# EAGLE design PowerRailV2 (EAGLE 9.6.2)
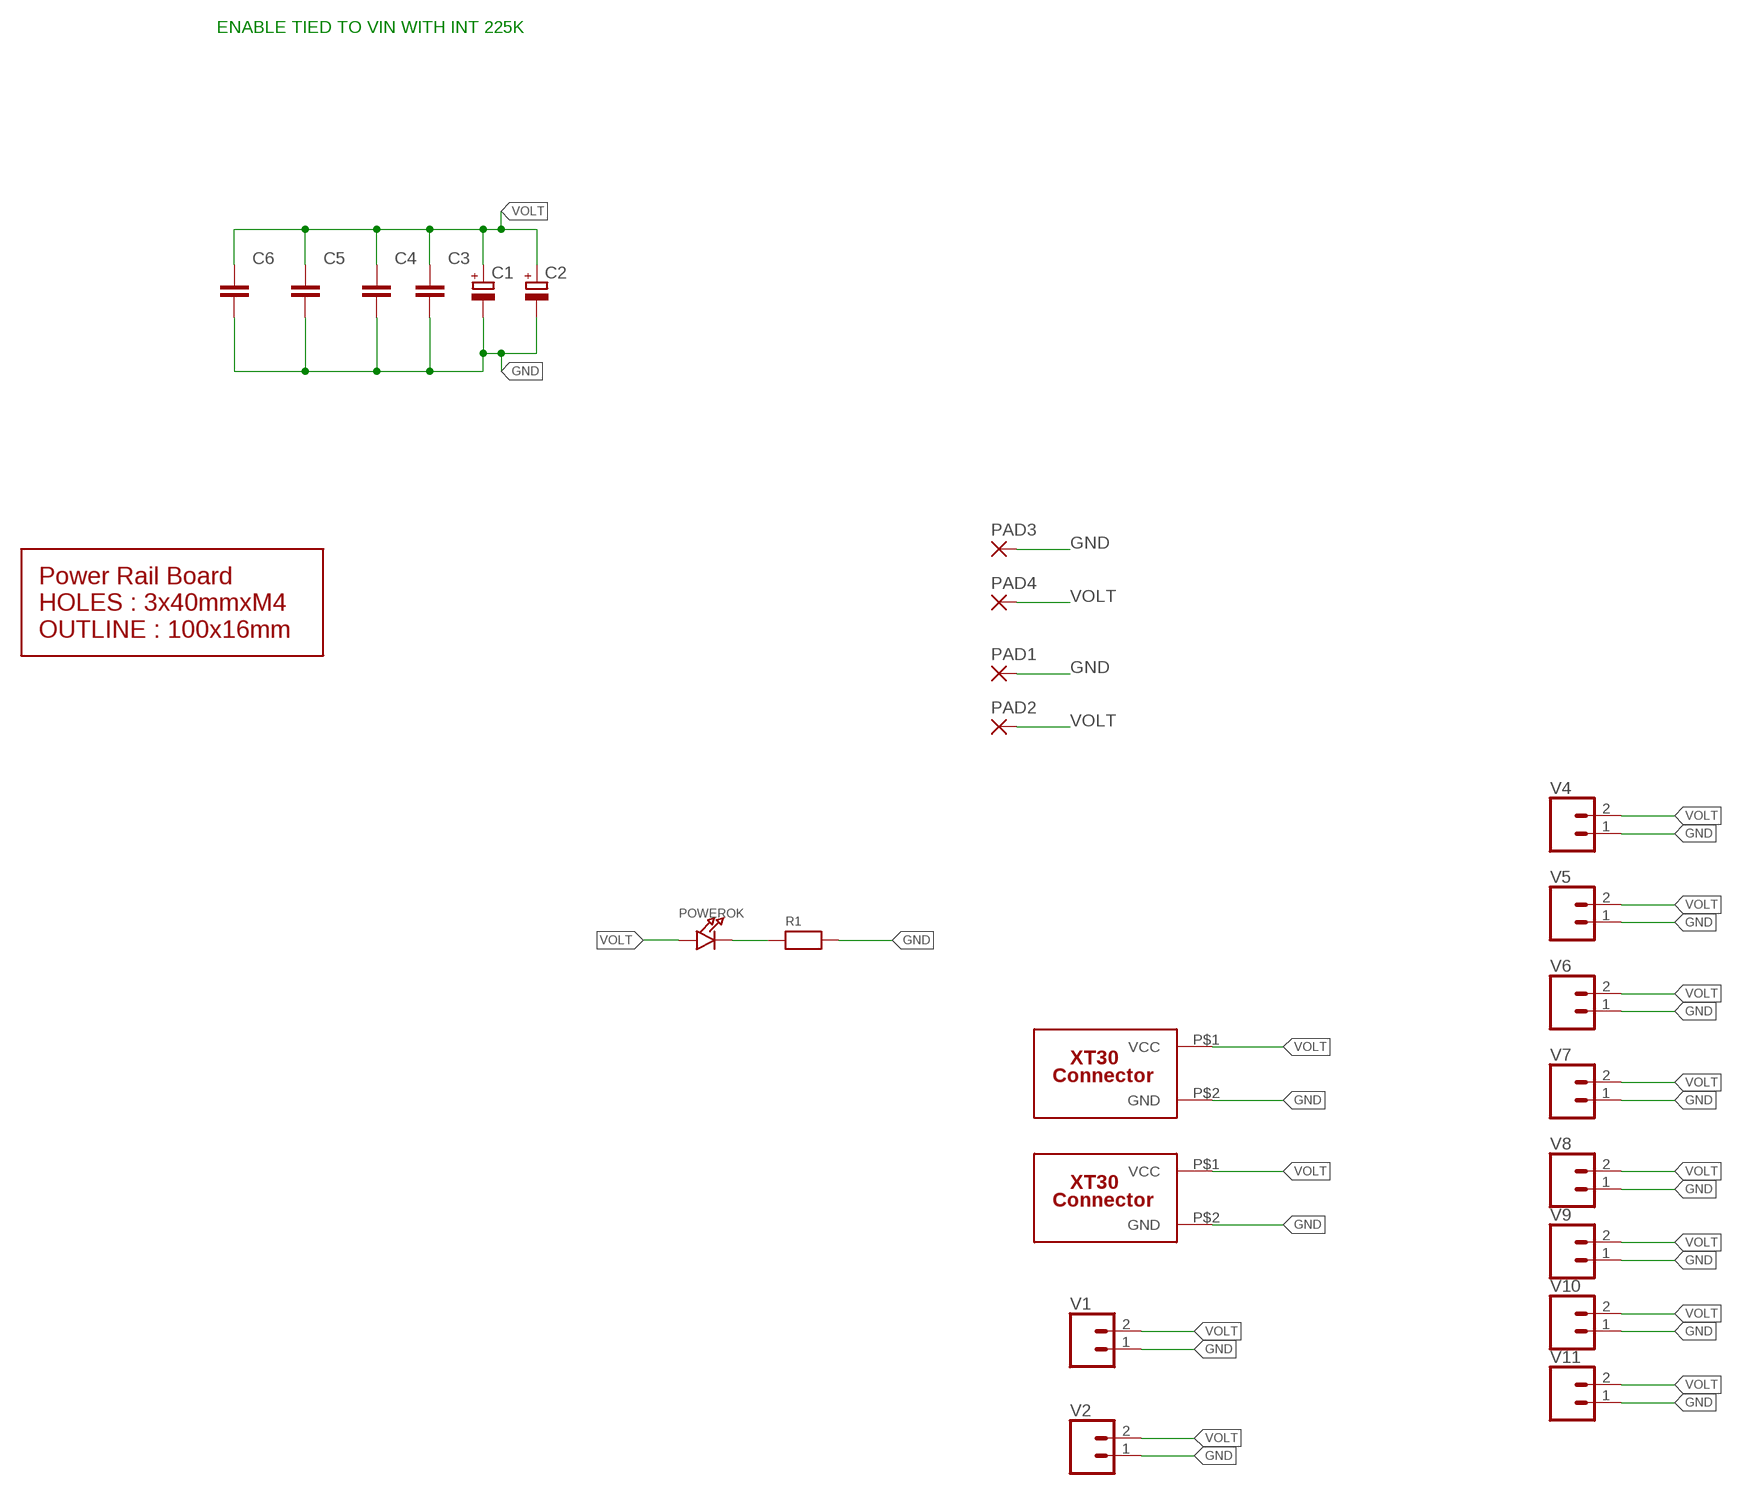
[diagram p0: schematic, sheet 1]

## Parts
C1  CPOL-EUE5-6  [E5-6]
C2  CPOL-EUE5-6  [E5-6]
C3  CAPACITOR_NPOL-0805  [C805]
C4  CAPACITOR_NPOL-0805  [C805]
C5  CAPACITOR_NPOL-1206  [C1206]
C6  CAPACITOR_NPOL-1206  [C1206]
PAD1  SMD2  [SMD1,27-2,54]
PAD2  SMD2  [SMD1,27-2,54]
PAD3  SMD2  [SMD1,27-2,54]
PAD4  SMD2  [SMD1,27-2,54]
POWEROK  LED0805  [CHIPLED_0805]
R1  RESISTOR0805  [0805]
U$3  BOARD_POWERRAI_PCB  [POWERRAIL_8-LED]
U$4  XT30  [XT30-VERT]
U$6  XT30  [XT30-VERT]
V1  CONN_023.5MM  [SCREWTERMINAL-3.5MM-2]
V2  CONN_023.5MM  [SCREWTERMINAL-3.5MM-2]
V4  CONN_023.5MM  [SCREWTERMINAL-3.5MM-2]
V5  CONN_023.5MM  [SCREWTERMINAL-3.5MM-2]
V6  CONN_023.5MM  [SCREWTERMINAL-3.5MM-2]
V7  CONN_023.5MM  [SCREWTERMINAL-3.5MM-2]
V8  CONN_023.5MM  [SCREWTERMINAL-3.5MM-2]
V9  CONN_023.5MM  [SCREWTERMINAL-3.5MM-2]
V10  CONN_023.5MM  [SCREWTERMINAL-3.5MM-2]
V11  CONN_023.5MM  [SCREWTERMINAL-3.5MM-2]

## Nets
GND: C1.- C2.- C3.2 C4.2 C5.2 C6.2 PAD1.1(P) PAD3.1(P) R1.2 U$4.P$2(GND) U$6.P$2(GND) V1.1 V2.1 V4.1 V5.1 V6.1 V7.1 V8.1 V9.1 V10.1 V11.1
N$3: POWEROK.C R1.1
VOLT: C1.+ C2.+ C3.1 C4.1 C5.1 C6.1 PAD2.1(P) PAD4.1(P) POWEROK.A U$4.P$1(VCC) U$6.P$1(VCC) V1.2 V2.2 V4.2 V5.2 V6.2 V7.2 V8.2 V9.2 V10.2 V11.2

## Notes on the sheet
- ENABLE TIED TO VIN WITH INT 225K

## Library data of the parts
C1 C2 = resistor:CPOL-EU: POLARIZED CAPACITOR, European symbol
C3-C6 = dp_devices:CAPACITOR_NPOL: Non-Polarized capacitor in various packages
PAD1-PAD4 = wirepad:SMD2: SMD PAD
POWEROK = microbuilder:LED: LED 0603 - 0603 Surface Mount Package 2mA: Green LED - Low Power (3.9mcd, 2ma, 1.7Vf) - Digikey: 475-2709-2-ND Orange LED - Low Power (9.8mcd, 2ma, 1.8Vf) - Digikey: 475-1194-2-ND Red LED - Low Power (5mcd, 2ma, 1.8Vf) - Digikey: 475-1195-2-ND Yellow LED - Low Power (7mcd, 2ma, 1.8Vf) - Digikey: 475-1196-2-ND 5mA: Blue LED - Low Power (17mcd, 5ma, 2.9Vf) - Digikey: LNJ937W8CRACT-ND 0805 - 0805 Surface Mount Package 2mA: Red LED (8.8mcd, 2mA, 1.8Vf, Clear) - Low Power [Digikey: 475-2510-1-ND] Green LED (5mcd, 2mA, 1.8Vf, Clear) - Low Power [Digikey: 475-2730-1-ND] Yellow LED (11.3mcd, 2mA, 1.8Vf, Clear) - Low Power [Digikey: 475-2555-1-ND] 20mA: Red LED (104mcd, 20mA, Diffused) - LS R976 [Digikey: 475-1278-6-ND] Red LED (12mcd, 20mA, 2.0Vf, Clear) - APT2012EC [Digikey: 754-1128-1-ND] Green LED (15mcd, 20mA, 2.2Vf, Clear) - APT2012GC [Digikey: 754-1131-1-ND] Orange LED (160mcd, 20mA, 2.1Vf, Clear) - APT2012SECK [Digikey: 754-1130-1-ND] 1206 - 1206 Surface Mount Package Green LED (26mcd, 20mA, Diffused) - LG N971 [Digikey: 475-1407-6-ND] Red LED (15mcd, 20mA, Diffused) - LH N974 [Digikey: 475-1416-6-ND]
R1 = microbuilder:RESISTOR: Resistors 0402 - 0402 Surface Mount Package 22 Ohm 1% 1/16W [Digikey: 311-22.0LRTR-ND] 33 Ohm 5% 1/16W 1.0K 5% 1/16W 1.5K 5% 1/16W 2.0K 1% 1/16W 10.0K 1% 1/16W [Digikey: 311-10.0KLRTR-ND] 10.0K 5% 1/16W [Digikey: RMCF0402JT10K0TR-ND] 12.1K 1% 1/16W [Digikey: 311-22.0LRTR-ND] 100.0K 5% 1/16W 0603 - 0603 Surface Mount Package 0 Ohm 1/10 Watt 1% Resistor 15 Ohm 1/10 Watt 1% Resistor 33 Ohm 1/10 Watt 1% Resistor 49.9 Ohm 1/10 Watt 1% Resistor 100 Ohm 1/10 Watt 1% Resistor 150 Ohm 1/10 Watt 1% Resistor 240 Ohm 1/10 Watt 1% Resistor 390 Ohm 1/10 Watt 1% Resistor 560 Ohm 1/10 Watt 1% Resistor 680 Ohm 1/10 Watt 1% Resistor 750 Ohm 1/10 Watt 1% Resistor 1.0K Ohm 1/10 Watt 1% Resistor 1.5K Ohm 1/10 Watt 1% Resistor 2.0K Ohm 1/10 Watt 1% Resistor 2.2K Ohm 1/10 Watt 1% Resistor 3.3K Ohm 1/10 Watt 1% Resistor 4.7K Ohm 1/10 Watt 1% Resistor 10.0K Ohm 1/10 Watt 1% Resistor 12.0K Ohm 1/10 Watt 1% Resistor 12.1K Ohm 1/10 Watt 1% Resistor 20.0K Ohm 1/10 Watt 1% Resistor 33.0K Ohm 1/10 Watt 1% Resistor 100.0K Ohm 1/10 Watt 1% Resistor 0805 - 0805 Surface Mount Package 0 Ohm 1/8 Watt 1% Resistor 33 Ohm 1/8 Watt 1% Resistor 100 Ohm 1/8 Watt 1% Resistor 150 Ohm 1/8 Watt 1% Resistor 200 Ohm 1/8 Watt 1% Resistor 240 Ohm 1/8 Watt 1% Resistor 330 Ohm 1/8 Watt 1% Resistor 390 Ohm 1/8 Watt 1% Resistor 470 Ohm 1/8 Watt 1% Resistor 1.0K Ohm 1/8 Watt 1% Resistor 1.5K Ohm 1/8 Watt 1% Resistor 2.0K Ohm 1/8 Watt 1% Resistor 4.7K Ohm 1/8 Watt 1% Resistor 5.1K Ohm 1/8 Watt 1% Resistor 5.6K Ohm 1/8 Watt 1% Resistor 10.0K Ohm 1/8 Watt 1% Resistor 22.0K Ohm 1/8 Watt 1% Resistor 33.0K Ohm 1/8 Watt 1% Resistor 100K Ohm 1/8 Watt 1% Resistor 1206 - 1206 Surface Mount Package 2012 - 2010 Surface Mount Package 0.11 Ohm 1/2 Watt 1% Resistor - Digikey: RHM.11UCT-ND
U$3 = MyBreadBoards:BOARD_POWERRAI_PCB
U$4 U$6 = MyBreadBoards:XT30
V1 V2 V4-V11 = SparkFun-Connectors:CONN_02: Multi connection point. Often used as Generic Header-pin footprint for 0.1 inch spaced/style header connections On any of the 0.1 inch spaced packages, you can populate with these: Break Away Headers - Straight <https://www.sparkfun.com/products/116> (PRT-00116) Break Away Male Headers - Right Angle <https://www.sparkfun.com/products/553> (PRT-00553) Female Headers <https://www.sparkfun.com/products/115> (PRT-00115) Break Away Headers - Machine Pin <https://www.sparkfun.com/products/117> (PRT-00117) Break Away Female Headers - Swiss Machine Pin <https://www.sparkfun.com/products/743> (PRT-00743) For SCREWTERMINALS and SPRING TERMINALS visit here: Screw Terimnals on SparkFun.com <https://www.sparkfun.com/search/results?term=Screw+Terminals> (5mm/3.5mm/2.54mm spacing) This device is also useful as a general connection point to wire up your design to another part of your project. Our various solder wires solder well into these plated through hole pads. Hook-Up Wire - Assortment (Stranded, 22 AWG) <https://www.sparkfun.com/products/11375> (PRT-11375) Hook-Up Wire - Assortment (Solid Core, 22 AWG) <https://www.sparkfun.com/products/11367> (PRT-11367) View the entire wire category on our website here <https://www.sparkfun.com/categories/141> Special notes: Molex polarized connector foot print use with: PRT-08233 with associated crimp pins and housings. 2.54_SCREWTERM for use with PRT-10571. 3.5mm Screw Terminal footprints for PRT-08084 5mm Screw Terminal footprints for use with PRT-08432; PROD_ID: CONN-08399

## Board
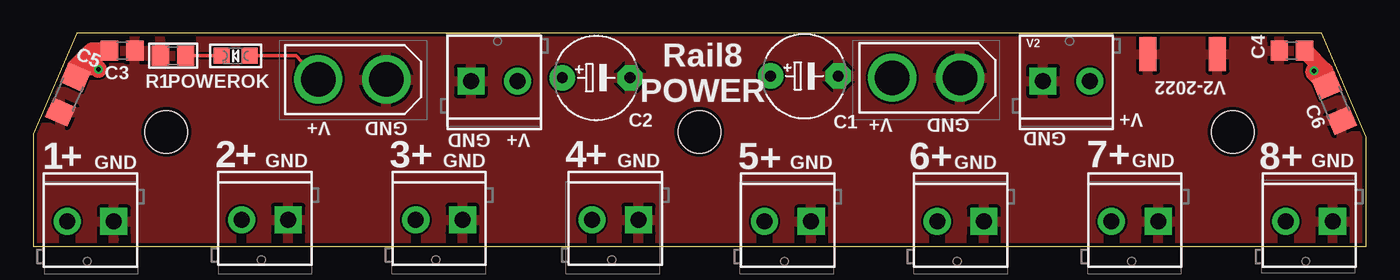
[diagram p1: board, top side]
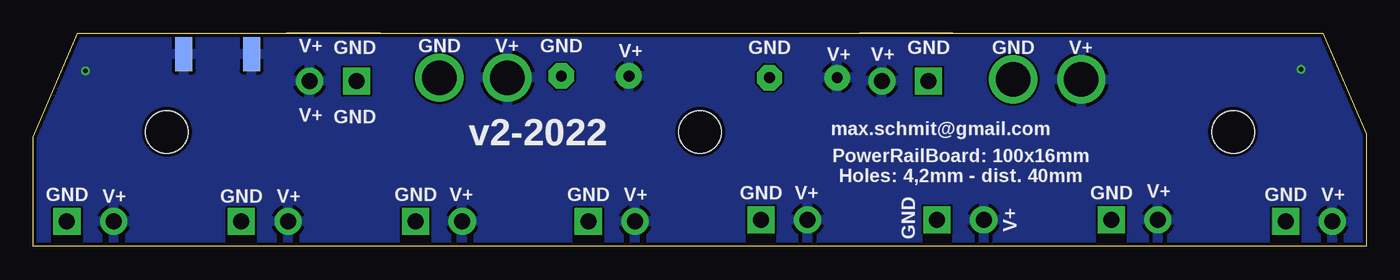
[diagram p2: board, bottom side, seen from below]

Size 100 x 16 mm. Coordinates in mm from the lower left corner, seen from the top.
Copper layers (1*16): Top 0.035mm / dielectric 1.5mm / Bottom 0.035mm
Design rules "dirt_cheap_dirty_boards.v1.1": minimum track width 6mil, minimum drill 12mil, track to track 6mil, track to pad 6mil, pad to pad 6mil, via to via 6mil, smd to smd 0mil, copper to edge 10mil, drill to drill 10mil, minimum pad ring 10mil, minimum via ring 6mil, stop-mask expansion 2mil, vias tented up to drill 25mil, thermal gap 10mil

### Footprints (pad centres in the part's own frame; a part is rotated, then mirrored left to right if it is on the bottom)
E5-6 = drill 0.813 pad 1.905: + -2.54,0 | drill 0.813 pad 1.905 octagon: - 2.54,0
C805 = smd 1.3 x 1.5: 1 -0.95,0; 2 0.95,0
C1206 = smd 1.6 x 1.803: 1 -1.422,0; 2 1.422,0
SMD1,27-2,54 = smd 1.27 x 2.54: 1 0,0
CHIPLED_0805 = smd 1.2 x 1.2: A 0,-1.05; C 0,1.05
0805 = smd 1.3 x 1.5: 1 -0.95,0; 2 0.95,0
POWERRAIL_8-LED = hole 3.2: 40.132,8.763; 0.127,8.763; -39.878,8.763
XT30-VERT = drill 2.6: P$1 0.127,7.771; P$2 0.127,2.667
SCREWTERMINAL-3.5MM-2 = drill 1.2 pad 2.032 square: 1 0,0 | drill 1.2 pad 2.032: 2 3.5,0

### Placement (x,y rotation side)
C1  57.85,12.79 0 top
C2  42.23,12.66 0 top
C3  6.67,14.69 0 top
C4  94.43,14.69 180 top
C5  2.61,11.39 246.4 top
C6  97.6,10.76 293 top
PAD1  88.84,14.44 180 top
PAD2  83.63,14.44 0 bottom
PAD3  83.63,14.44 180 top
PAD4  88.71,14.44 0 bottom
POWEROK  15.18,14.31 90 top
R1  10.48,14.31 180 top
U$3  49.85,-0.16 0 top
U$4  29.15,12.41 90 top
U$6  72.2,12.54 90 top
V1  32.83,12.41 0 top
V2  75.76,12.41 0 top
V4  19.12,1.99 180 top
V5  32.2,1.99 180 top
V6  45.41,1.99 180 top
V7  58.36,1.87 180 top
V8  71.31,1.87 180 top
V9  84.39,1.87 180 top
V10  97.48,1.87 180 top
V11  6.04,1.87 180 top

### Tracks (layer width: path | path; a pad name or v marks a point on that pad's centre or on a via)
GND
  pour Top: -3.49,18.89 -3.49,-1.82 -0.7,-4.61 98.75,-4.61 103.19,-0.16 103.19,13.81 99.38,17.62 -0.95,17.62 -2.22,18.89
N$3
  Top 0.254: R1.1 POWEROK.C
VOLT  (via drill 0.35)
  Top 0.254: POWEROK.A 19.7,14.31 U$4.P$1
  Top 0.762: C6.1 96.92,12.07
  Top 1.27: C4.1 96.9,13.17 97.05,12.83 C6.1 96.08,13.03 v96.08,13.17 | C5.1 3.18,13.49 | 3.18,13.49 4.38,14.69 C3.1 | 3.18,13.49 4.7,13.49 v4.89,13.3
  pour Bottom: -3.49,18.89 -3.49,-3.59 -0.95,-6.13 97.22,-6.13 103.19,-0.16 103.19,13.81 99.38,17.62 -0.95,17.62 -2.22,18.89

### Text on the board
tPlace: Rail8 / POWER | V2-2022 | V+ | V+ | GND | V+ | GND | GND | V+ | GND | 1 | + | 2 | + | 3 | + | 4 | + | 5 | + | 6 | + | 7 | + | 8 | + | GND | GND | GND | GND | GND | GND | GND | GND
bPlace: V+ | GND | GND | GND | V+ | GND | V+ | GND | GND | V+ | V+ | V+ | v2-2022 | GND | V+ | max.schmit@gmail.com | PowerRailBoard: 100x16mm / Holes: 4,2mm - dist. 40mm | V+ | GND | V+ | GND | V+ | GND | V+ | GND | V+ | GND | V+ | GND | V+ | GND | V+ | GND
tStop: - | -
bStop: + | +